# EAGLE design Adder (EAGLE 9.6.2)
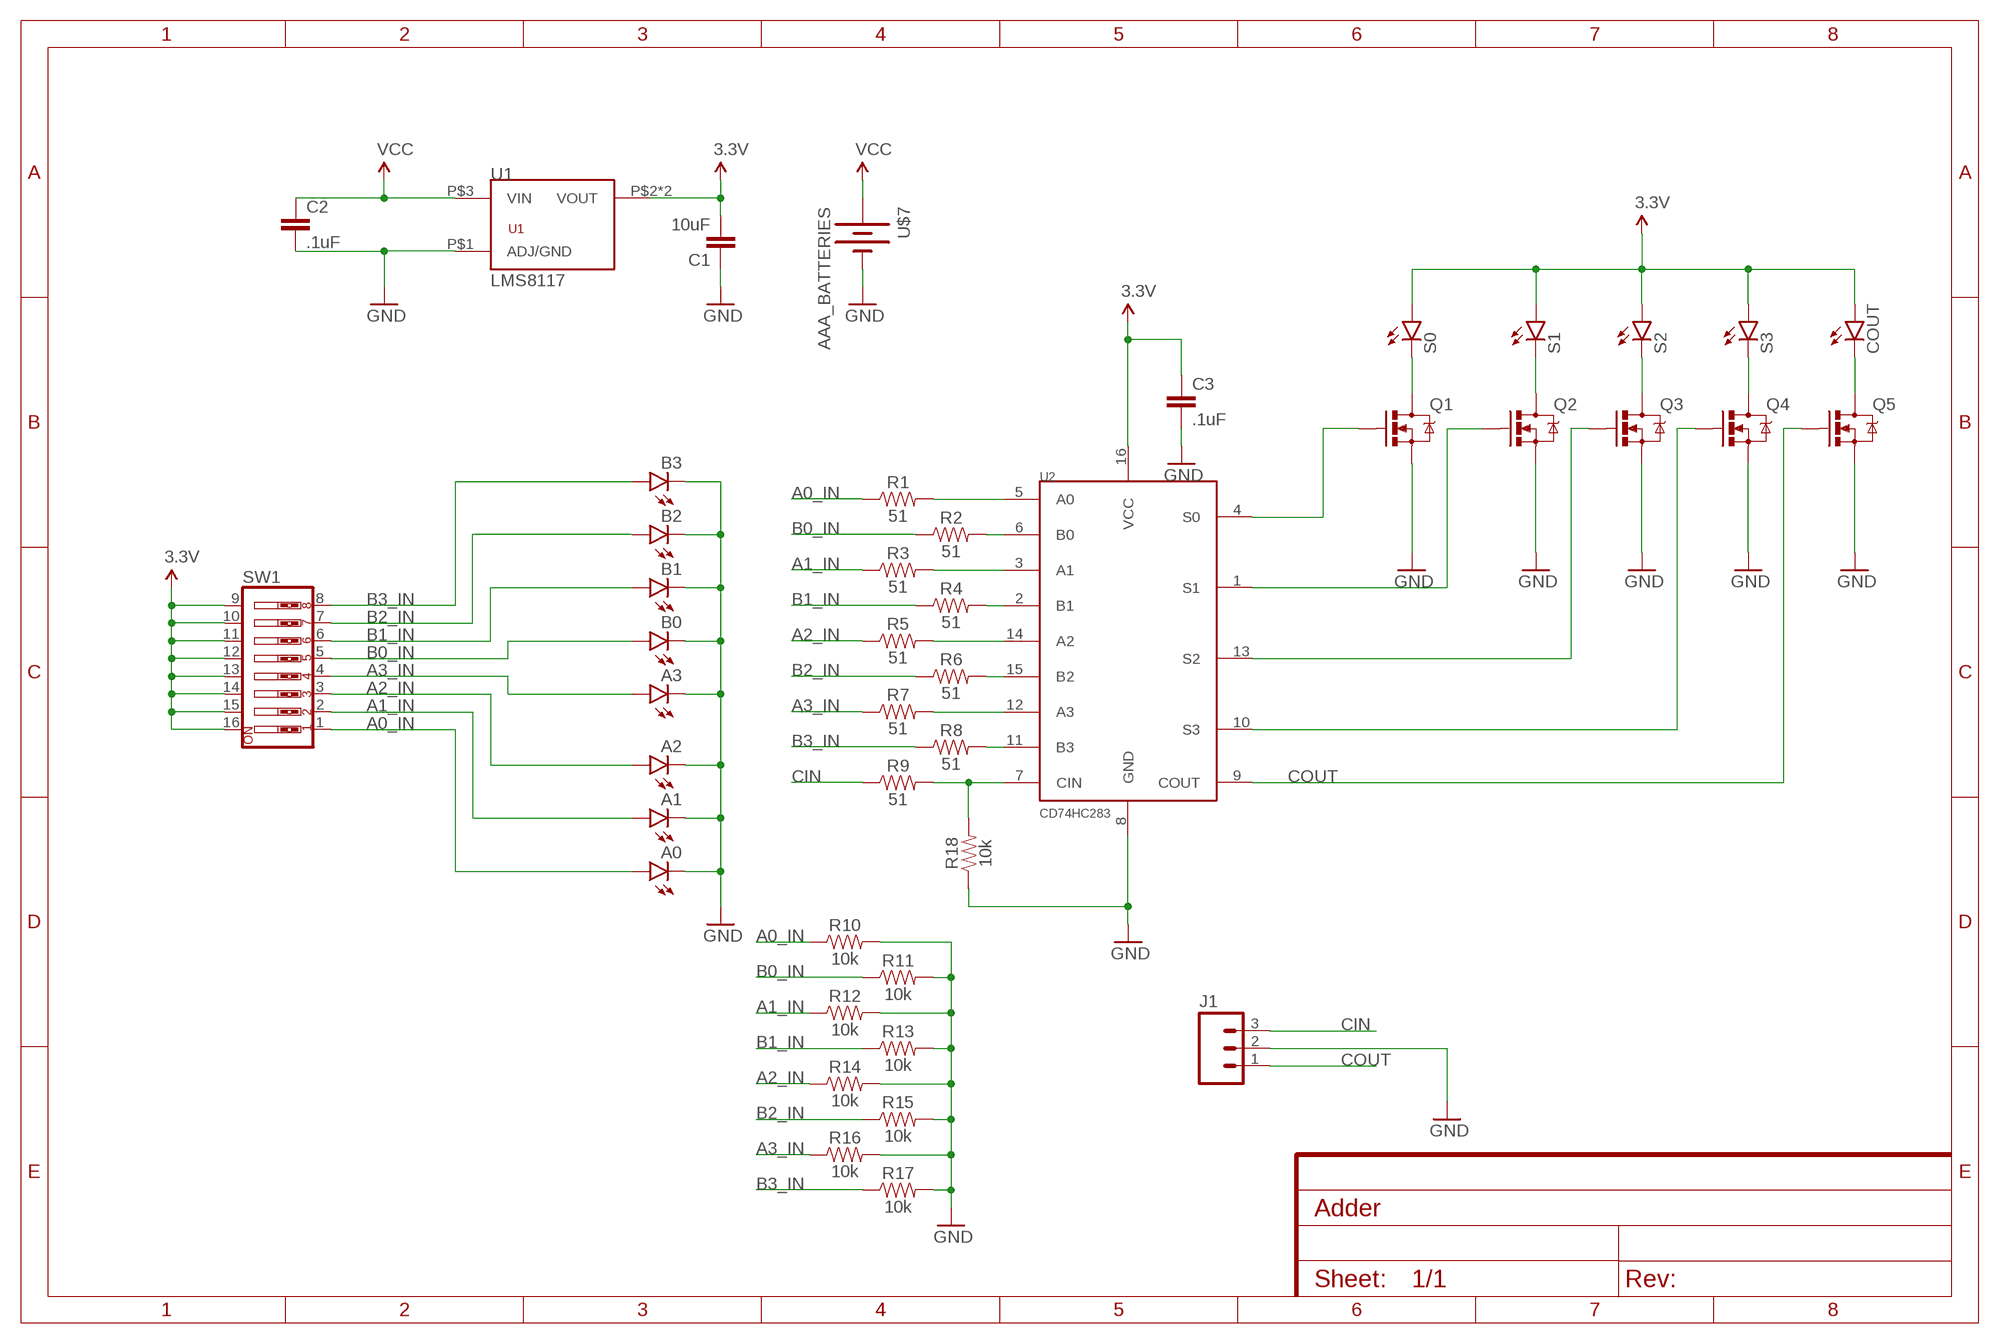
[diagram p0: schematic, sheet 1]

## Parts
A0  LED5MM  [LED5MM]
A1  LED5MM  [LED5MM]
A2  LED5MM  [LED5MM]
A3  LED5MM  [LED5MM]
B0  LED5MM  [LED5MM]
B1  LED5MM  [LED5MM]
B2  LED5MM  [LED5MM]
B3  LED5MM  [LED5MM]
C1  10uF  CAP0603-CAP  [0603-CAP]
C2  .1uF  CAP0603-CAP  [0603-CAP]
C3  .1uF  CAP0603-CAP  [0603-CAP]
COUT  LED5MM  [LED5MM]
J1  M03PTH  [1X03]
Q1  MOSFET-NCHANNEL2N7000  [TO-92]
Q2  MOSFET-NCHANNEL2N7000  [TO-92]
Q3  MOSFET-NCHANNEL2N7000  [TO-92]
Q4  MOSFET-NCHANNEL2N7000  [TO-92]
Q5  MOSFET-NCHANNEL2N7000  [TO-92]
R1  51  RESISTOR0805  [0805]
R2  51  RESISTOR0805  [0805]
R3  51  RESISTOR0805  [0805]
R4  51  RESISTOR0805  [0805]
R5  51  RESISTOR0805  [0805]
R6  51  RESISTOR0805  [0805]
R7  51  RESISTOR0805  [0805]
R8  51  RESISTOR0805  [0805]
R9  51  RESISTOR0805  [0805]
R10  10k  RESISTOR0805  [0805]
R11  10k  RESISTOR0805  [0805]
R12  10k  RESISTOR0805  [0805]
R13  10k  RESISTOR0805  [0805]
R14  10k  RESISTOR0805  [0805]
R15  10k  RESISTOR0805  [0805]
R16  10k  RESISTOR0805  [0805]
R17  10k  RESISTOR0805  [0805]
R18  10k  RESISTOR0805  [0805]
S0  LED5MM  [LED5MM]
S1  LED5MM  [LED5MM]
S2  LED5MM  [LED5MM]
S3  LED5MM  [LED5MM]
SW1  SW_DIP-8  [DIPSWITCH-08]
U1  LMS8117  [SOT-223]
U2  CD74HC283  [SO016]
U$7  AAA_BATTERIES  [WIRE_LEADS]

## Nets
3.3V: C1.2 C3.1 COUT.A S0.A S1.A S2.A S3.A SW1.9 SW1.10 SW1.11 SW1.12 SW1.13 SW1.14 SW1.15 SW1.16 U1.P$2(VOUT) U1.P$4(VOUT) U2.16(VCC)
A0_IN: A0.A R1.1 R10.1 SW1.1
A1_IN: A1.A R3.1 R12.1 SW1.2
A2_IN: A2.A R5.1 R14.1 SW1.3
A3_IN: A3.A R7.1 R16.1 SW1.4
B0_IN: B0.A R2.1 R11.1 SW1.5
B1_IN: B1.A R4.1 R13.1 SW1.6
B2_IN: B2.A R6.1 R15.1 SW1.7
B3_IN: B3.A R8.1 R17.1 SW1.8
CIN: J1.3 R9.1
COUT: J1.1 Q5.2(G) U2.9(COUT)
GND: A0.K(C) A1.K(C) A2.K(C) A3.K(C) B0.K(C) B1.K(C) B2.K(C) B3.K(C) C1.1 C2.2 C3.2 J1.2 Q1.1(S) Q2.1(S) Q3.1(S) Q4.1(S) Q5.1(S) R10.2 R11.2 R12.2 R13.2 R14.2 R15.2 R16.2 R17.2 R18.1 U1.P$1(ADJ/GND) U2.8(GND) U$7.P$1(-)
N$1: Q2.2(G) U2.1(S1)
N$2: Q3.2(G) U2.13(S2)
N$3: Q4.2(G) U2.10(S3)
N$4: Q1.2(G) U2.4(S0)
N$6: Q1.3(D) S0.K(C)
N$7: Q2.3(D) S1.K(C)
N$8: Q3.3(D) S2.K(C)
N$9: Q4.3(D) S3.K(C)
N$10: COUT.K(C) Q5.3(D)
N$32: R1.2 U2.5(A0)
N$33: R2.2 U2.6(B0)
N$34: R3.2 U2.3(A1)
N$35: R4.2 U2.2(B1)
N$36: R5.2 U2.14(A2)
N$37: R6.2 U2.15(B2)
N$38: R7.2 U2.12(A3)
N$39: R8.2 U2.11(B3)
N$40: R9.2 R18.2 U2.7(CIN)
VCC: C2.1 U1.P$3(VIN) U$7.P$2(+)

## Library data of the parts
A0 A1-A3 B0 B1-B3 COUT S0 S1-S3 = SparkFun-LED:LED: LEDs Standard schematic elements and footprints for 5mm, 3mm, 1206, and 0603 sized LEDs. 5mm - Spark Fun Electronics SKU : COM-00529 (and others)
C1-C3 = SparkFun-Capacitors:CAP: Capacitor Standard 0603 ceramic capacitor, and 0.1" leaded capacitor.
J1 = SparkFun-Connectors:M03: Header 3 Standard 3-pin 0.1" header. Use with straight break away headers (SKU : PRT-00116), right angle break away headers (PRT-00553), swiss pins (PRT-00743), machine pins (PRT-00117), and female headers (PRT-00115). Molex polarized connector foot print use with SKU : PRT-08232 with associated crimp pins and housings.
Q1-Q5 = SparkFun-DiscreteSemi:MOSFET-NCHANNEL: Common NMOSFET Parts MFG P/N Store ID Prod ID FDD8780 TRANS-09984 SI7820DN TRANS-11055 FDS6630A IC-08089 2N7002PW TRANS-11151 FQP30N06L COM-10213 TRANS-10060 BSS123LT1G TRANS-08345 BSS138 TRANS-00830 BS170 2N7000
R1-R18 = SparkFun-Resistors:RESISTOR: Generic Resistor Package
SW1 = SparkFun-Electromechanical:SW_DIP-8: DIP Switch 8 Position
U1 = BB8:LMS8117: 3.3V Linear Regulator
U2 = Soldering Workshop Library:CD74HC283: A 4 bit adder
U$7 = Soldering Workshop Library:AAA_BATTERIES

## Net classes
0 default: width 0.203 mm

## Board
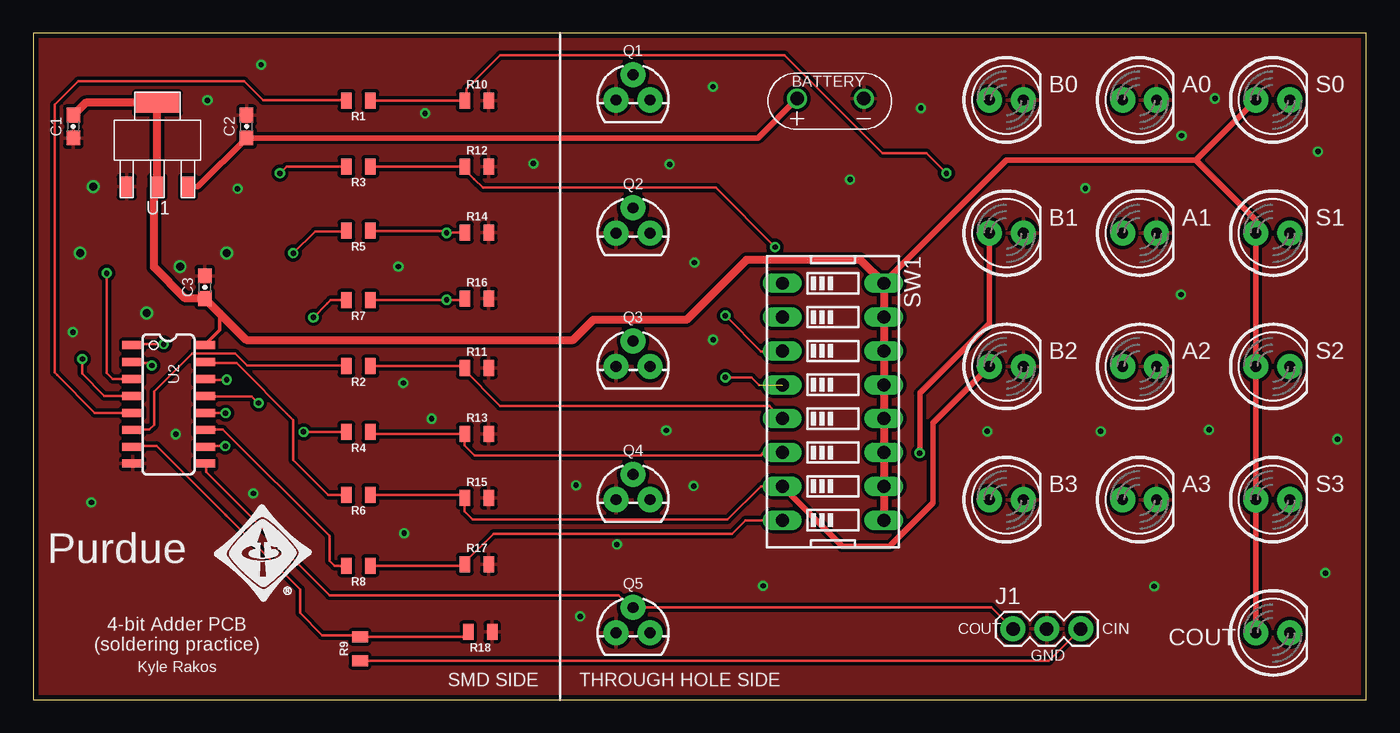
[diagram p1: board, top side]
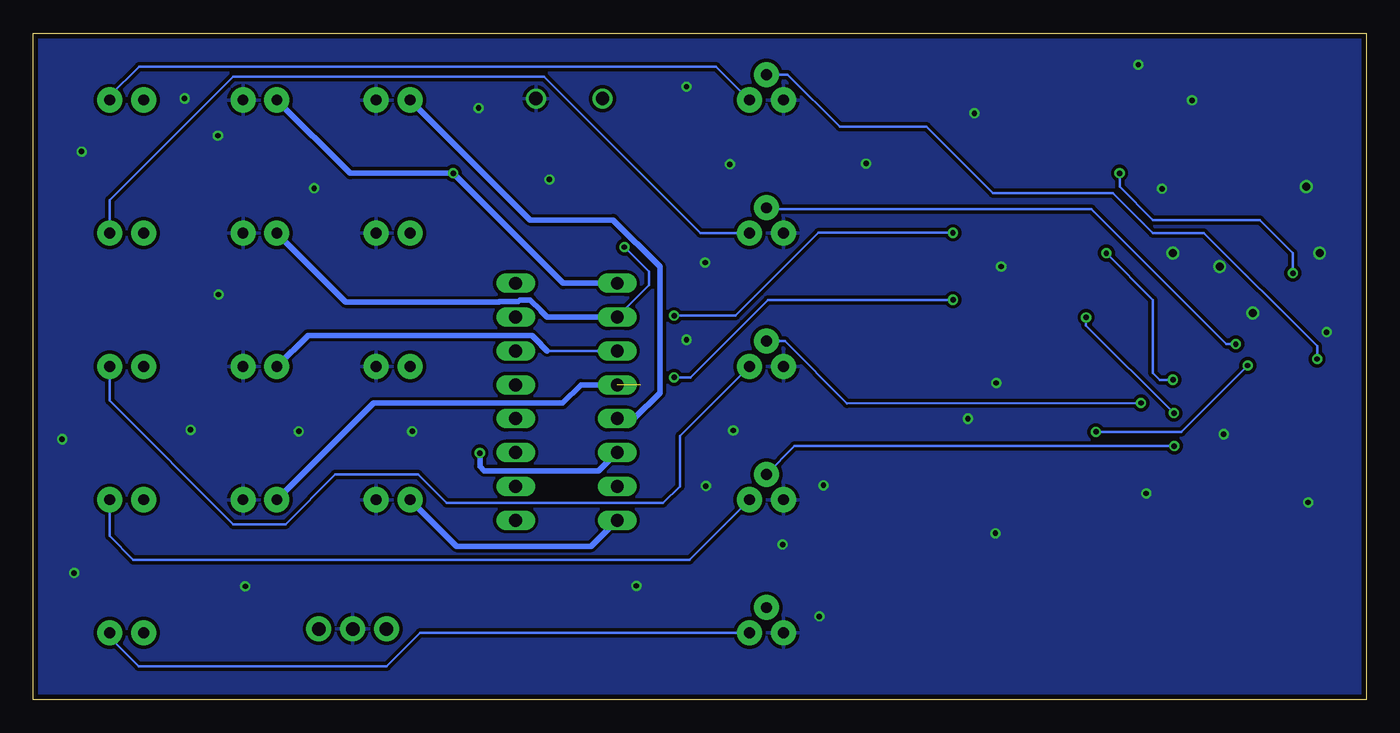
[diagram p2: board, bottom side, seen from below]

Size 100 x 50 mm. Coordinates in mm from the lower left corner, seen from the top.
Outline: 0,0 100,0 100,50 0,50 0,0
Copper layers (1*16): Top 0.0356mm / dielectric 1.5011mm / Bottom 0.0356mm
Design rules "ECE_Senior_Design": minimum track width 8mil, minimum drill 13mil, track to track 8mil, track to pad 8mil, pad to pad 6mil, via to via 8mil, smd to smd 6mil, copper to edge 15mil, drill to drill 8mil, minimum pad ring 7mil, minimum via ring 7mil, stop-mask expansion 3mil, vias tented up to drill 0mil, thermal gap 10mil

### Footprints (pad centres in the part's own frame; a part is rotated, then mirrored left to right if it is on the bottom)
LED5MM = drill 0.813 pad 1.88: A -1.27,0; K 1.27,0
0603-CAP = smd 1.118 x 1.016: 1 -0.85,0; 2 0.85,0
1X03 = drill 1.016 pad 1.88: 1 0,0; 2 2.54,0; 3 5.08,0
TO-92 = drill 0.813 pad 1.88: 1 -1.27,0; 2 0,1.905; 3 1.27,0
0805 = smd 0.8 x 1.2: 1 -0.9,0; 2 0.9,0
DIPSWITCH-08 = drill 0.97 long: 1 -8.89,-3.81; 2 -6.35,-3.81; 3 -3.81,-3.81; 4 -1.27,-3.81; 5 1.27,-3.81; 6 3.81,-3.81; 7 6.35,-3.81; 8 8.89,-3.81; 9 8.89,3.81; 10 6.35,3.81; 11 3.81,3.81; 12 1.27,3.81; 13 -1.27,3.81; 14 -3.81,3.81; 15 -6.35,3.81; 16 -8.89,3.81
SOT-223 = smd 1 x 1.5: P$1 -2.3,0; P$2 0,0; P$3 2.3,0 | smd 3.3 x 1.5: P$4 0,6.3
SO016 = smd 0.6 x 1.55: 1 -4.445,-2.7; 2 -3.175,-2.7; 3 -1.905,-2.7; 4 -0.635,-2.7; 5 0.635,-2.7; 6 1.905,-2.7; 7 3.175,-2.7; 8 4.445,-2.7; 9 4.445,2.7; 10 3.175,2.7; 11 1.905,2.7; 12 0.635,2.7; 13 -0.635,2.7; 14 -1.905,2.7; 15 -3.175,2.7; 16 -4.445,2.7
WIRE_LEADS = drill 1: P$1 0,0; P$2 5,0

### Placement (x,y rotation side)
A0  83,45 0 top
A1  83,35 0 top
A2  83,25 0 top
A3  83,15 0 top
B0  73,45 0 top
B1  73,35 0 top
B2  73,25 0 top
B3  73,15 0 top
C1  3,43 90 top
C2  16,43 90 top
C3  12.87,30.95 90 top
COUT  93,5 0 top
J1  73.5,5.3 0 top
Q1  45,45 0 top
Q2  45,35 0 top
Q3  45,25 0 top
Q4  45,15 0 top
Q5  45,5 0 top
R1  24.38,44.96 180 top
R2  24.38,25.02 180 top
R3  24.38,40.01 180 top
R4  24.38,20.07 180 top
R5  24.38,35.18 180 top
R6  24.38,15.37 180 top
R7  24.38,29.97 180 top
R8  24.38,10.03 180 top
R9  24.51,3.81 90 top
R10  33.27,44.96 0 top
R11  33.27,24.89 0 top
R12  33.27,40.01 0 top
R13  33.27,19.94 0 top
R14  33.27,35.05 0 top
R15  33.27,15.11 0 top
R16  33.27,30.1 0 top
R17  33.27,10.16 0 top
R18  33.53,5.08 180 top
S0  93,45 0 top
S1  93,35 0 top
S2  93,25 0 top
S3  93,15 0 top
SW1  60,22.35 270 top
U1  9.3,38.48 0 top
U2  10.15,22.15 270 top
U$7  62.3,45.1 180 top

### Tracks (layer width: path | path; a pad name or v marks a point on that pad's centre or on a via)
3.3V
  Top 0.203: 63.75,13.25 SW1.9
  Top 0.254: U2.16 13.98,27.73 13.98,28.98
  Top 0.406: U1.P$2 9.3,38.5 | S0.A 87.23,40.5 | 87.23,40.5 73,40.5 63.81,31.31 SW1.16 | 87.23,40.5 91.73,36 S1.A S2.A S3.A COUT.A
  Top 0.61: 9.3,38.5 9.05,38.25 9.05,32.45 11.4,30.1 C3.1 13.98,28.98 15.97,27 40.5,27 42,28.5 49,28.5 53.5,33 62.05,33 SW1.16 SW1.15 SW1.14 SW1.13 SW1.12 SW1.11 SW1.10 63.81,13.31 63.75,13.25 | U1.P$2 U1.P$4 3.93,44.78 C1.2
A0_IN  (via drill 0.4)
  Top 0.203: v68.5,39.5 67,41 63.72,41 56.36,48.36 35.38,48.36 35.03,48.36 32.51,45.85 32.51,45.1 R10.1 R1.1
  Bottom 0.406: SW1.1 60.24,31.24 66.86,37.86 v68.5,39.5 76.23,39.5 A0.A
A1_IN  (via drill 0.4)
  Top 0.203: v55.65,33.96 51.21,38.41 33.73,38.41 33.07,39.06 32.37,39.76 R12.1 R3.1
  Bottom 0.203: v55.65,33.96 53.8,32.11 53.8,31.09 SW1.2
  Bottom 0.406: SW1.2 61.45,28.7 61.9,29.15 61.9,29.18 62.72,30 63.5,30 63.63,29.87 65.03,29.87 65.06,29.84 76.58,29.84 A1.A
A2_IN  (via drill 0.4)
  Top 0.203: SW1.3 56.19,26.14 54.59,26.14 v51.92,28.8 | R5.1 25.31,35.15 30.88,35.15 v31,35.03 32.35,35.03 R14.1
  Bottom 0.203: SW1.3 61.45,26.16 | v51.92,28.8 47.33,28.8 41.1,35.03 33,35.03 v31,35.03
  Bottom 0.406: 61.45,26.16 61.9,26.61 61.9,26.64 62.59,27.33 79.4,27.33 A2.A
A3_IN  (via drill 0.4)  (1 unrouted)
  Top 0.203: v51.92,24.18 53.87,24.18 54.43,23.62 | R16.1 32.27,30 v31,30 25.31,30 R7.1
  Bottom 0.203: v51.92,24.18 50.7,24.18 44.89,30 v31,30
  Bottom 0.406: A3.A 74.48,22.25 60.28,22.25 58.91,23.62 SW1.4
B0_IN
  Top 0.203: SW1.5 55.22,22.05 35.03,22.05 32.25,24.83 32.25,25.02 | R2.1 32.25,25.02 | 32.25,25.02 R11.1
  Bottom 0.406: B0.A 62.73,36 56.5,36 53,32.5 53,23 54.92,21.08 SW1.5
B1_IN  (via drill 0.4)
  Top 0.203: SW1.6 56.19,18.49 54.76,18.49 54.59,18.31 33.12,18.31 32.37,19.06 R13.1 25.41,19.94 R4.1
  Top 0.406: B1.A 71.73,28.23 66.5,23 v66.5,18.5
  Bottom 0.203: 56.12,18.61 SW1.6
  Bottom 0.406: v66.5,18.5 66.5,17.5 66.17,17.17 62.59,17.17 62.56,17.14 57.59,17.14 56.12,18.61
B2_IN
  Top 0.203: SW1.7 56.01,16 54.59,16 52.09,13.51 33.6,13.51 32.97,13.51 32.37,14.11 R15.1 32.12,15.37 R6.1
  Top 0.406: B2.A 67.5,20.77 67.5,14.76 64.25,11.5 60.69,11.5 SW1.7
B3_IN
  Top 0.203: SW1.8 53.41,13.46 52.4,12.45 34.53,12.45 32.37,10.29 R17.1 32.25,10.03 R8.1
  Bottom 0.406: B3.A 68.23,11.5 58.15,11.5 SW1.8
CIN
  Top 0.203: R9.1 76.19,2.91 J1.3
COUT
  Top 0.203: U2.9 12.98,17.6 12.98,17.07 22.23,7.82 43.92,7.82 44.84,6.91 Q5.2 71.89,6.91 J1.1
GND  (via drill 0.4, 0.6)
  other vias: 16.51,15.46 51,27 4.5,38.5 3.5,33.5 8.5,29 11,32.5 14.5,33.5 4.36,14.8 17.1,47.64 27.39,32.49 27.81,12.48 27.75,23.76 29.4,44 37.52,40.23 29.89,21.08 2.97,27.57 15.32,38.33 13.06,44.97 47.49,20.19 49.55,16.02 40.72,16.08 43.78,11.63 41.03,6.23 54.76,8.53 84.09,8.49 96.94,9.49 47.75,40.17 49.59,32.8 50.99,45.99 61.28,39.03 66.6,44.39 78.93,38.37 86.11,30.39 96.38,41.13 71.57,20.13 80.09,20.13 88.21,20.24 97.84,19.54 86.15,42.32 88.65,45.11 10.69,19.91
  pour Top (isolate 0.254): 0,50 0,0 100,0 100,50
  pour Bottom (isolate 0.254): -0.5,50.5 -0.5,-0.5 100.5,-0.5 100.5,50.5
N$1  (via drill 0.4)
  Top 0.203: v9.78,26.67 7.47,26.67 U2.1
  Bottom 0.203: v9.78,26.67 10.49,26.67 20.62,36.8 44.9,36.8 Q2.2
N$2  (via drill 0.4)
  Top 0.203: U2.13 12.98,22.76 16.38,22.76 v16.89,22.25
  Bottom 0.203: v16.89,22.25 38.94,22.23 43.62,26.91 Q3.2
N$3  (via drill 0.4)
  Top 0.203: v14.4,19.02 12.98,19.02 U2.10
  Bottom 0.203: Q4.2 42.88,19.02 v14.4,19.02
N$4  (via drill 0.4)
  Top 0.203: U2.4 5.33,22.79 3.66,24.46 3.66,25.53 v3.68,25.55
  Bottom 0.203: Q1.2 43.41,46.91 39.5,43 33,43 28,38 19,38 16,35 12.16,35 3.68,26.52 v3.68,25.55
N$6
  Bottom 0.203: Q1.3 48.77,47.5 50.96,47.5 51,47.5 92.07,47.5 94.27,45.3 S0.K
N$7
  Bottom 0.203: S1.K 94.27,37.48 84.99,46.76 61.7,46.76 49.94,35 Q2.3
N$8
  Bottom 0.203: S2.K 94.27,22.44 84.99,13.16 81.08,13.16 77.34,16.89 71.12,16.89 68.99,14.76 52.74,14.76 51.5,16 51.5,19.77 Q3.3
N$9
  Bottom 0.203: S3.K 94.27,12.27 92.49,10.49 50.78,10.49 Q4.3
N$10
  Bottom 0.203: COUT.K 94.23,4.98 94.23,4.62 92.11,2.5 73.5,2.5 71,5 Q5.3
N$32
  Top 0.203: U2.5 7.29,21.51 4.62,21.51 1.78,24.35 1.6,24.54 1.6,44.63 3.38,46.41 15.82,46.41 17.25,44.98 23.46,44.98 R1.2
N$33
  Top 0.203: U2.6 7.47,20.27 8.71,20.27 9.07,20.62 9.07,23.11 11.91,25.95 15.15,25.95 16.04,25.07 23.43,25.07 R2.2
N$34  (via drill 0.4)
  Top 0.203: U2.3 5.95,24.05 5.5,24.5 v5.5,32 | v18.5,39.5 19,40 R3.2
  Bottom 0.203: v5.5,32 5.5,33.5 8,36 16,36 18.5,38.5 v18.5,39.5
N$35  (via drill 0.4)
  Top 0.203: v8.89,25.07 8.71,25.25 7.47,25.25 U2.2 | R4.2 23.46,20.09 v20.27,20.09
  Bottom 0.203: v20.27,20.09 13.87,20.09 v8.89,25.07
N$36  (via drill 0.4)
  Top 0.203: U2.14 12.98,24.18 13.16,24 v14.5,24 | v19.5,33.5 21.13,35.13 23.43,35.13 R5.2
  Bottom 0.203: v19.5,33.5 16,30 16,24.5 15.5,24 v14.5,24
N$37
  Top 0.203: U2.15 12.98,25.25 15.25,25.25 19.5,21 19.5,18 22.13,15.37 R6.2
N$38  (via drill 0.4)
  Top 0.203: v21.01,28.68 22.05,29.72 22.3,29.97 R7.2 | U2.12 12.98,21.51 14.4,21.51 v14.42,21.49
  Bottom 0.203: v14.42,21.49 21.01,28.08 v21.01,28.68
N$39
  Top 0.203: U2.11 12.98,20.27 14.22,20.27 22.23,12.27 22.23,10.41 22.61,10.03 R8.2
N$40
  Top 0.203: U2.7 7.47,19.02 9.25,19.02 14.38,13.88 14.5,13.77 20,8.27 20,6.5 21.67,4.83 24.39,4.83 R9.2 32.26,4.71 R18.2
VCC
  Top 0.406: U$7.P$2 54.35,42.15 C2.1 12.33,38.48 U1.P$3

### Text on the board
tPlace: Purdue | COUT | CIN | 4-bit Adder PCB / (soldering practice) | GND | Kyle Rakos | SMD SIDE | THROUGH HOLE SIDE | C:/Users/rakos/Downloads/ieee_mono.bmp | C:/Users/rakos/Downloads/ieee_mono_logo.bmp